# Altium schematic sheet CPU.SchDoc
size A3
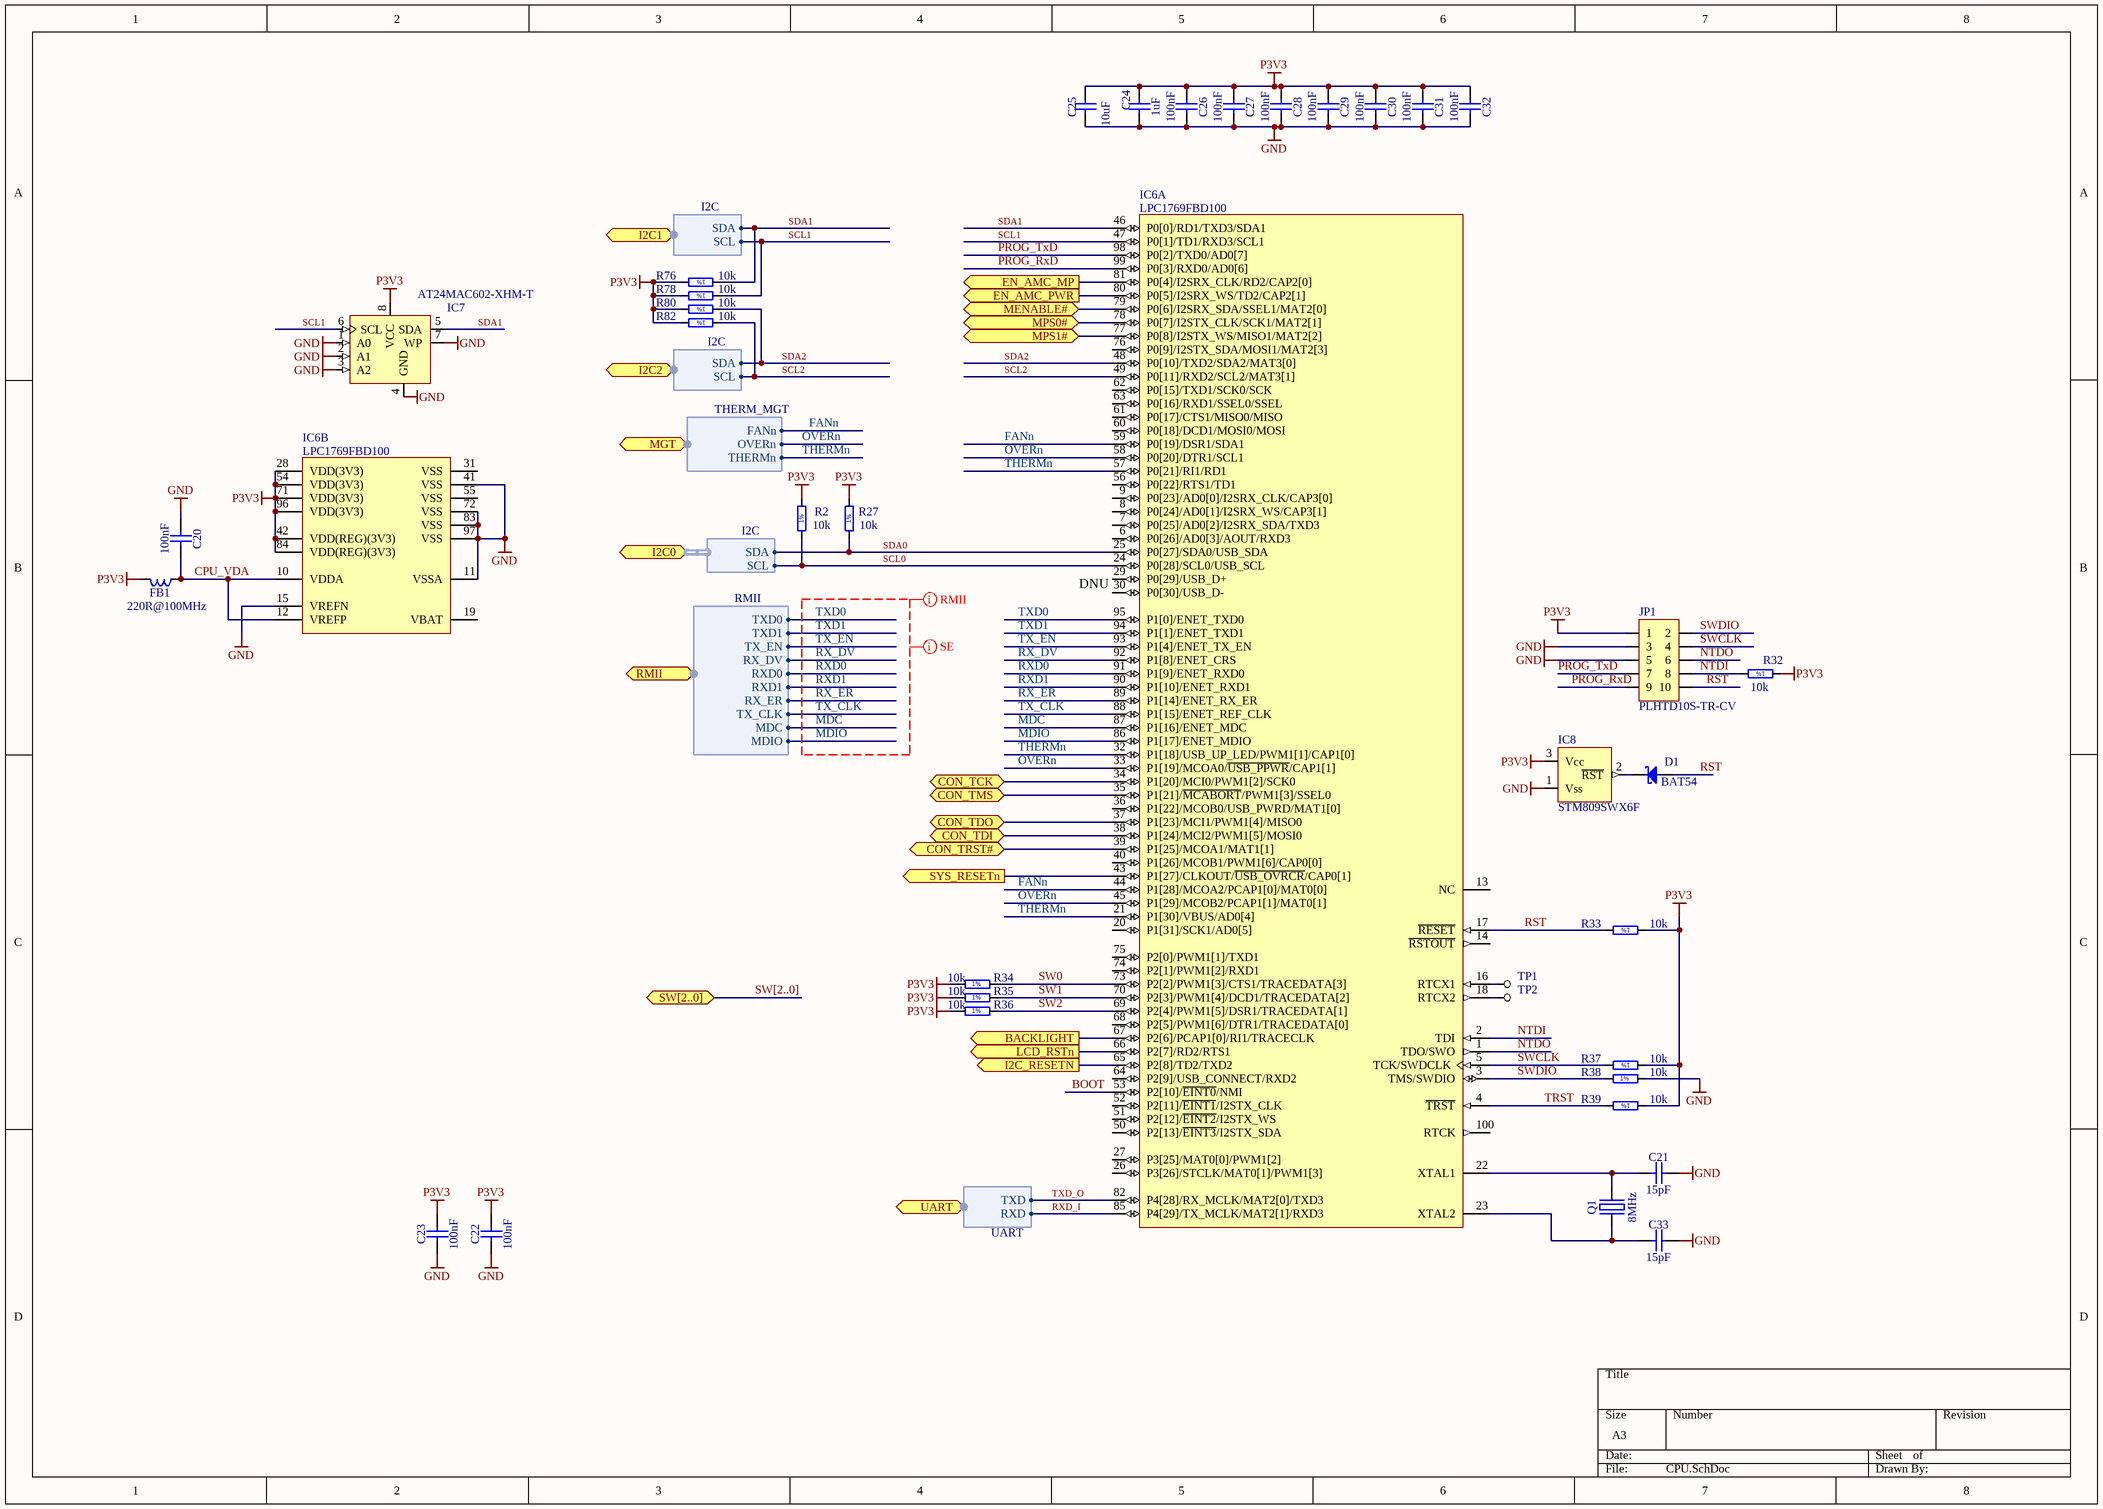
[diagram p0: CPU.SchDoc]

## Parts
C20  100nF  [CAPC1005X55N]
C21  15pF  [CAPC1005X55N]
C22  100nF  [CAPC1005X55N]
C23  100nF  [CAPC1005X55N]
C24  1uF  [CAPC1608X87N]
C25  10uF  [CAPC2012X135N]
C26  100nF  [CAPC1005X55N]
C27  100nF  [CAPC1005X55N]
C28  100nF  [CAPC1005X55N]
C29  100nF  [CAPC1005X55N]
C30  100nF  [CAPC1005X55N]
C31  100nF  [CAPC1005X55N]
C32  100nF  [CAPC1005X55N]
C33  15pF  [CAPC1005X55N]
D1  BAT54  [SOT95P240X130-3N]
FB1  220R@100MHz  [INDC2012X105N]
IC6  LPC1769FBD100  [QFP50P1600X1600X160-100N]  (parts A,B of 2)
IC7  AT24MAC602-XHM-T  [TSSOP-8]
IC8  STM809SWX6F  [SOT-23]
JP1  PLHTD10S-TR-CV  [PLHTD10S-TR-CV]
Q1  8MHz  [XTAL_TXC_7A]
R2  10k  [RESC1005X40N]
R27  10k  [RESC1005X40N]
R32  10k  [RESC1005X40N]
R33  10k  [RESC1005X40N]
R34  10k  [RESC1005X40N]
R35  10k  [RESC1005X40N]
R36  10k  [RESC1005X40N]
R37  10k  [RESC1005X40N]
R38  10k  [RESC1005X40N]
R39  10k  [RESC1005X40N]
R76  10k  [RESC1005X40N]
R78  10k  [RESC1005X40N]
R80  10k  [RESC1005X40N]
R82  10k  [RESC1005X40N]
TP1  TP  [TP]  (value not drawn)
TP2  TP  [TP]  (value not drawn)

## Ports
BACKLIGHT (out), CON_TCK (bidir), CON_TDI (bidir), CON_TDO (bidir), CON_TMS (bidir), CON_TRST#, EN_AMC_MP (out), EN_AMC_PWR (out), I2C0 (harness I2C), I2C1 (harness I2C), I2C2 (harness I2C), I2C_RESETN (out), LCD_RSTn (out), MENABLE# (bidir), MGT (harness THERM_MGT), MPS0# (bidir), MPS1# (bidir), RMII (harness RMII), SW[2..0] (bidir), SYS_RESETn (out), UART (harness UART)

## Harnesses
I2C: SCL, SDA
THERM_MGT: OVERn, THERMn, FANn
UART: RXD, TXD
RMII: TXD0, TXD1, TX_EN, RX_DV, RXD0, RXD1, RX_ER, TX_CLK, MDC, MDIO

## Nets
GND: C20.1 C21.2 C22.1 C23.1 C24.1 C25.2 C26.1 C27.1 C28.1 C29.1 C30.1 C31.1 C32.1 C33.2 IC6.11(VSSA) IC6.15(VREFN) IC6.41(VSS) IC6.72(VSS) IC6.83(VSS) IC6.97(VSS) IC7.1(A0) IC7.2(A1) IC7.3(A2) IC7.4(GND) IC7.7(WP) IC8.1(Vss) JP1.3 JP1.5 R38.2
P3V3: C22.2 C23.2 C24.2 C25.1 C26.2 C27.2 C28.2 C29.2 C30.2 C31.2 C32.2 FB1.2 IC6.28(VDD(3V3)) IC6.42(VDD(REG)(3V3)) IC6.54(VDD(3V3)) IC6.71(VDD(3V3)) IC6.84(VDD(REG)(3V3)) IC6.96(VDD(3V3)) IC7.8(VCC) IC8.3(Vcc) JP1.1 R2.2 R27.2 R32.1 R33.1 R34.1 R35.1 R36.1 R37.1 R39.1 R76.2 R78.2 R80.2 R82.2
BACKLIGHT: IC6.67(P2[6]/PCAP1[0]/RI1/TRACECLK) ; port BACKLIGHT
BOOT: IC6.53(P2[10]/~{EINT0}/NMI)
CON_TCK: IC6.34(P1[20]/MCI0/PWM1[2]/SCK0) ; port CON_TCK
CON_TDI: IC6.38(P1[24]/MCI2/PWM1[5]/MOSI0) ; port CON_TDI
CON_TDO: IC6.37(P1[23]/MCI1/PWM1[4]/MISO0) ; port CON_TDO
CON_TMS: IC6.35(P1[21]/~{MCABORT}/PWM1[3]/SSEL0) ; port CON_TMS
CON_TRST#: IC6.39(P1[25]/MCOA1/MAT1[1]) ; port CON_TRST#
CPU_VDA: C20.2 FB1.1 IC6.10(VDDA) IC6.12(VREFP)
EN_AMC_MP: IC6.81(P0[4]/I2SRX_CLK/RD2/CAP2[0]) ; port EN_AMC_MP
EN_AMC_PWR: IC6.80(P0[5]/I2SRX_WS/TD2/CAP2[1]) ; port EN_AMC_PWR
FANn: IC6.44(P1[28]/MCOA2/PCAP1[0]/MAT0[0]) IC6.59(P0[19]/DSR1/SDA1) ; port MGT.FANn
I2C_RESETN: IC6.65(P2[8]/TD2/TXD2) ; port I2C_RESETN
LCD_RSTn: IC6.66(P2[7]/RD2/RTS1) ; port LCD_RSTn
MDC: IC6.87(P1[16]/ENET_MDC) ; port RMII.MDC
MDIO: IC6.86(P1[17]/ENET_MDIO) ; port RMII.MDIO
MENABLE#: IC6.79(P0[6]/I2SRX_SDA/SSEL1/MAT2[0]) ; port MENABLE#
MPS0#: IC6.78(P0[7]/I2STX_CLK/SCK1/MAT2[1]) ; port MPS0#
MPS1#: IC6.77(P0[8]/I2STX_WS/MISO1/MAT2[2]) ; port MPS1#
NTDI: IC6.2(TDI) JP1.8 R32.2
NTDO: IC6.1(TDO/SWO) JP1.6
OVERn: IC6.33(P1[19]/MCOA0/~{USB_PPWR}/CAP1[1]) IC6.45(P1[29]/MCOB2/PCAP1[1]/MAT0[1]) IC6.58(P0[20]/DTR1/SCL1) ; port MGT.OVERn
PROG_RxD: IC6.99(P0[3]/RXD0/AD0[6]) JP1.9
PROG_TxD: IC6.98(P0[2]/TXD0/AD0[7]) JP1.7
RST: D1.1(A) IC6.17(~{RESET}) JP1.10 R33.2
RX_DV: IC6.92(P1[8]/ENET_CRS) ; port RMII.RX_DV
RX_ER: IC6.89(P1[14]/ENET_RX_ER) ; port RMII.RX_ER
RXD0: IC6.91(P1[9]/ENET_RXD0) ; port RMII.RXD0
RXD1: IC6.90(P1[10]/ENET_RXD1) ; port RMII.RXD1
RXD_I: IC6.85(P4[29]/TX_MCLK/MAT2[1]/RXD3) ; port UART.RXD
SCL0: IC6.24(P0[28]/SCL0/USB_SCL) R2.1 ; port I2C0.SCL
SCL1: IC6.47(P0[1]/TD1/RXD3/SCL1) IC7.6(SCL) R78.1 ; port I2C1.SCL
SCL2: IC6.49(P0[11]/RXD2/SCL2/MAT3[1]) R82.1 ; port I2C2.SCL
SDA0: IC6.25(P0[27]/SDA0/USB_SDA) R27.1 ; port I2C0.SDA
SDA1: IC6.46(P0[0]/RD1/TXD3/SDA1) IC7.5(SDA) R76.1 ; port I2C1.SDA
SDA2: IC6.48(P0[10]/TXD2/SDA2/MAT3[0]) R80.1 ; port I2C2.SDA
SW0: IC6.73(P2[2]/PWM1[3]/CTS1/TRACEDATA[3]) R34.2
SW1: IC6.70(P2[3]/PWM1[4]/DCD1/TRACEDATA[2]) R35.2
SW2: IC6.69(P2[4]/PWM1[5]/DSR1/TRACEDATA[1]) R36.2
SWCLK: IC6.5(TCK/SWDCLK) JP1.4 R37.2
SWDIO: IC6.3(TMS/SWDIO) JP1.2 R38.1
SYS_RESETn: IC6.43(P1[27]/CLKOUT/~{USB_OVRCR}/CAP0[1]) ; port SYS_RESETn
THERMn: IC6.21(P1[30]/VBUS/AD0[4]) IC6.32(P1[18]/USB_UP_LED/PWM1[1]/CAP1[0]) IC6.57(P0[21]/RI1/RD1) ; port MGT.THERMn
TRST: IC6.4(~{TRST}) R39.2
TX_CLK: IC6.88(P1[15]/ENET_REF_CLK) ; port RMII.TX_CLK
TX_EN: IC6.93(P1[4]/ENET_TX_EN) ; port RMII.TX_EN
TXD0: IC6.95(P1[0]/ENET_TXD0) ; port RMII.TXD0
TXD1: IC6.94(P1[1]/ENET_TXD1) ; port RMII.TXD1
TXD_O: IC6.82(P4[28]/RX_MCLK/MAT2[0]/TXD3) ; port UART.TXD
NetC21_1: C21.1 IC6.22(XTAL1) Q1.2(OSC2)
NetC33_1: C33.1 IC6.23(XTAL2) Q1.1(OSC1)
NetD1_3: D1.3(C) IC8.2(~{RST})
NetIC6_16: IC6.16(RTCX1) TP1.1
NetIC6_18: IC6.18(RTCX2) TP2.1

Not connected (* = marked no-connect by the designer): IC6 6(P0[26]/AD0[3]/AOUT/RXD3) 7(P0[25]/AD0[2]/I2SRX_SDA/TXD3) 8(P0[24]/AD0[1]/I2SRX_WS/CAP3[1]) 9(P0[23]/AD0[0]/I2SRX_CLK/CAP3[0]) 13(NC) 14(~{RSTOUT}) 19(VBAT) 20(P1[31]/SCK1/AD0[5]) 26(P3[26]/STCLK/MAT0[1]/PWM1[3]) 27(P3[25]/MAT0[0]/PWM1[2]) 29(P0[29]/USB_D+) 30(P0[30]/USB_D-) 31(VSS) 36(P1[22]/MCOB0/USB_PWRD/MAT1[0]) 40(P1[26]/MCOB1/PWM1[6]/CAP0[0]) 50(P2[13]/~{EINT3}/I2STX_SDA) 51(P2[12]/~{EINT2}/I2STX_WS) 52(P2[11]/~{EINT1}/I2STX_CLK) 55(VSS) 56(P0[22]/RTS1/TD1) 60(P0[18]/DCD1/MOSI0/MOSI) 61(P0[17]/CTS1/MISO0/MISO) 62(P0[15]/TXD1/SCK0/SCK) 63(P0[16]/RXD1/SSEL0/SSEL) 64(P2[9]/USB_CONNECT/RXD2) 68(P2[5]/PWM1[6]/DTR1/TRACEDATA[0]) 74(P2[1]/PWM1[2]/RXD1) 75(P2[0]/PWM1[1]/TXD1) 76(P0[9]/I2STX_SDA/MOSI1/MAT2[3]) 100(RTCK)

## Buses and harness runs
bus SW[2..0] = port SW[2..0]

## Layout directives
net class RMII: MDC, MDIO, RX_DV, RX_ER, RXD0, RXD1, TX_CLK, TX_EN, TXD0, TXD1
net class SE: MDC, MDIO, RX_DV, RX_ER, RXD0, RXD1, TX_CLK, TX_EN, TXD0, TXD1

## Notes on the sheet
- (near IC6) DNU
- (in symbol R0402_10K_1%_0.0625W_100PPM) 1%

## Library data of the parts
C20 C22 C23 C26-C32 = CC0402_100NF_16V_10%_X5R: Non-polarised capacitor; Part Description: SMD Multilayer Chip Ceramic Capacitor; Manufacturer: GENERIC; Manufacturer1 Part Number: GRM155R61C104KA88D; Voltage: 16V; TC: X5R; Tolerance: ±10%; Part Number: CC0402_100NF_16V_10%_X5R; Component Kind: Standard; Component Type: Standard; Pin Count: 2; Value: 100nF; Status: None; Manufacturer Part Number: CC0402_100NF_16V_10%_X5R; Case: 0402; Mounted: Yes; Socket: No; SMD: Yes; Manufacturer1 Example: MURATA; Manufacturer1 ComponentHeight: 0.55mm; HelpURL: \\cern.ch\dfs\Applications\Altium\Datasheets\CC0402_X5R_MURATA_GRM.pdf; Author: CERN DEM JLC; CreateDate: 10.12.2013; LatestRevisionDate: 10.12.2013; Sense: No
C21 C33 = CC0402_15PF_50V_5%_C0G: Non-polarised capacitor; Part Description: SMD Multilayer Chip Ceramic Capacitor; Manufacturer: GENERIC; Manufacturer1 Part Number: C0402C150J5GACTU; Voltage: 50V; TC: C0G/NP0; Tolerance: ±5%; Part Number: CC0402_15PF_50V_5%_C0G; Component Kind: Standard; Component Type: Standard; Pin Count: 2; Value: 15pF; Status: Preferred; Manufacturer Part Number: CC0402_15PF_50V_5%_C0G; Case: 0402; Mounted: Yes; Socket: No; SMD: Yes; Sense: No; Manufacturer1 Example: KEMET; Manufacturer1 ComponentHeight: 0.55mm; HelpURL: \\cern.ch\dfs\Applications\Altium\Datasheets\CC0805_C0G_KEMET_(Commercial Grade).pdf; Author: CERN DEM JLC; CreateDate: 03.12.2007; LatestRevisionDate: 22.04.2015
C24 = CC0603_1UF_25V_10%_X7R: Non-polarised capacitor; Part Description: SMD Multilayer Chip Ceramic Capacitor; Manufacturer: GENERIC; Manufacturer1 Part Number: GRM188R71E105KA12D; Voltage: 25V; TC: X7R; Tolerance: ±10%; Table: Capacitors SMD; Part Number: CC0603_1UF_25V_10%_X7R; Component Kind: Standard; Component Type: Standard; Pin Count: 2; Value: 1uF; Status: None; Manufacturer Part Number: CC0603_1UF_25V_10%_X7R; Case: 0603; Mounted: Yes; Socket: No; SMD: Yes; Manufacturer1 Example: MURATA; Manufacturer1 ComponentHeight: 0.9mm; HelpURL: \\cern.ch\dfs\Applications\Altium\Datasheets\CC0603_X7R_MURATA.pdf; Author: CERN DEM JLC; CreateDate: 2011-01-18; LatestRevisionDate: 2011-01-18
C25 = CC0805_10UF_10V_10%_X7R: Non-polarised capacitor; Part Description: SMD Multilayer Chip Ceramic Capacitor; Manufacturer: GENERIC; Manufacturer1 Part Number: GRM21BR71A106KE51L; Voltage: 10V; TC: X7R; Tolerance: ±10%; Table: Capacitors SMD; Part Number: CC0805_10UF_10V_10%_X7R; Component Kind: Standard; Component Type: Standard; Pin Count: 2; Value: 10uF; Status: Preferred; Manufacturer Part Number: CC0805_10UF_10V_10%_X7R; Case: 0805; Mounted: Yes; Socket: No; SMD: Yes; Manufacturer1 Example: MURATA; Manufacturer1 ComponentHeight: 1.35mm; HelpURL: \\cern.ch\dfs\Applications\Altium\Datasheets\CC0805_X7R_MURATA.pdf; Author: CERN DEM JLC; CreateDate: 2012-04-30; LatestRevisionDate: 2012-04-30
D1 = BAT54: Diode Schottky  Anode Pin 1 Cathode Pin 3 (Pas de pin 2); Part Description: Single Small Signal Schottky Diode; Manufacturer: FAIRCHILD SEMICONDUCTOR; Voltage: 30V; Power: 200mA; Table: Diodes; Part Number: BAT54; Component Kind: Standard; Component Type: Standard; Device: BAT54; PackageDescription: SOT23 3-Leads, Pitch 0.95mm - Body 1.3x2.9mm, IPC Medium Density; Manufacturer Part Number: BAT54; Pin Count: 3; Case: SOT23-3; Mounted: Yes; Socket: No; SMD: Yes; ComponentHeight: 1.30mm; HelpURL: \\cern.ch\dfs\Applications\Altium\Datasheets\BAT54.pdf; Author: CERN DEM JLC; CreateDate: 2009-09-17; LatestRevisionDate: 2010-05-27
FB1 = IND0805_MURATA_BLM21PG221SN1D: Inductor; Part Description: SMD EMIFIL Suppression Chip Ferrite Bead; Manufacturer: MURATA; Power: 2A; Resistance: 0.05R; Tolerance: ±25%; Table: Inductors SMD; Part Number: IND0805_MURATA_BLM21PG221SN1D; Component Kind: Standard; Component Type: Standard; Pin Count: 2; Value: 220R@100MHz; Status: None; Manufacturer Part Number: BLM21PG221SN1D; Case: 0805; Mounted: Yes; Socket: No; SMD: Yes; ComponentHeight: 1.05mm; HelpURL: \\cern.ch\dfs\Applications\Altium\Datasheets\IND0402_MURATA_BLM21P.pdf; Author: CERN DEM JLC; CreateDate: 2010-01-25; LatestRevisionDate: 2010-01-25
IC6 = LPC1769FBD100: LPC1768 Series 64kB 120MHz 32-Bit ARM Cortex-M3 Microcontroller; Part Description: 32-bit 120MHz ARM Cortex-M3 Microcontroller, 512kB Flash, 64kB SRAM, with Ethernet, USB 2.0 Host/Device/OTG, CAN; Manufacturer: NXP SEMICONDUCTORS; PressFit: No; Bonding: No; Part Number: LPC1769FBD100; Component Kind: Standard; Component Type: Standard; Device: LPC1769FBD100; PackageDescription: QFP, 0.50mm Pitch, Square; 100 Pin,14.00mm L X 14.00mm W X 1.60mm H Body, IPC Medium Density; Manufacturer Part Number: LPC1769FBD100; Pin Count: 100; Case: QFP100; Mounted: Yes; Socket: No; SMD: Yes; Sense: No; ComponentHeight: 1.6mm; HelpURL: \\cern.ch\dfs\Applications\Altium\Datasheets\LPC1769FBD100.pdf; Author: CERN DEM JLC; CreateDate: 06.10.2016; LatestRevisionDate: 06.10.2016
IC7 = MEM_24MAC602: Serial 2K EEPROM+ 48bit MAC
IC8 = VMON_STM809: 2.93V  Reset circuit
JP1 = CON_2x5 1.27 SMT Male: 1.27 mm dual row goldpin (Maritex)
Q1 = XTAL_8MHZ_TXC_7A-8.000MAAE-T: Quartz Crystal; Part Description: Tolerance: ±30ppm, Stability: ±30ppm, -20°C to +70°C, 12pF, SMD Glass Seam Sealing Crystal, 7A Series; Manufacturer: TXC CORPORATION; PressFit: No; Bonding: No; Part Number: XTAL_8MHZ_TXC_7A-8.000MAAE-T; Component Kind: Standard; Component Type: Standard; PackageDescription: 2 Pins, 3.2x5mm, SMD Glass Seam Sealing Crystal, 7A Serie; Value: 8MHz; Manufacturer Part Number: 7A-8.000MAAE-T; Pin Count: 2; Mounted: Yes; Socket: No; SMD: Yes; Sense: No; ComponentHeight: 1.2mm; HelpURL: \\cern.ch\dfs\Applications\Altium\Datasheets\XTAL_TXC_7A.pdf; Author: CERN DEM JLC; CreateDate: 09.10.2014; LatestRevisionDate: 12.11.2014
R2 R27 R32-R39 R76 R78 R80 R82 = R0402_10K_1%_0.0625W_100PPM: Resistor - 1%; Part Description: General Purpose Thick Film Chip Resistor; Manufacturer: GENERIC; Manufacturer1 Part Number: 232270671003L; TC: ±100ppm/°C; Table: Resistors SMD; Part Number: R0402_10K_1%_0.0625W_100PPM; Component Kind: Standard; Component Type: Standard; Pin Count: 2; Value: 10k; Status: Not recommended; Power: 0.0625W; Tolerance: ±1%; Manufacturer Part Number: R0402_10K_1%_0.0625W_100PPM; Case: 0402; Mounted: Yes; Socket: No; SMD: Yes; Manufacturer1 Example: YAGEO PHYCOMP; Manufacturer1 ComponentHeight: 0.4mm; HelpURL: \\cern.ch\dfs\Applications\Altium\Datasheets\R0402_Phycomp_RC0402.pdf; Author: CERN DEM JLC; CreateDate: 2007-12-03; LatestRevisionDate: 2012-10-17
TP1 TP2 = TP: Testpoint